# EasyEDA Pro project ProProject_AT32_FOC_2024-04-27.epro, schematic AS5600
Create Date: 2023-11-18; Page Name: AS5600; Project Name: 基于AT32F413 的FOC驱动器; Schematic Name: AS5600; Update Date: 2024-04-27; Company: 嘉立创EDA; Page Size: A3; Version: V1.0
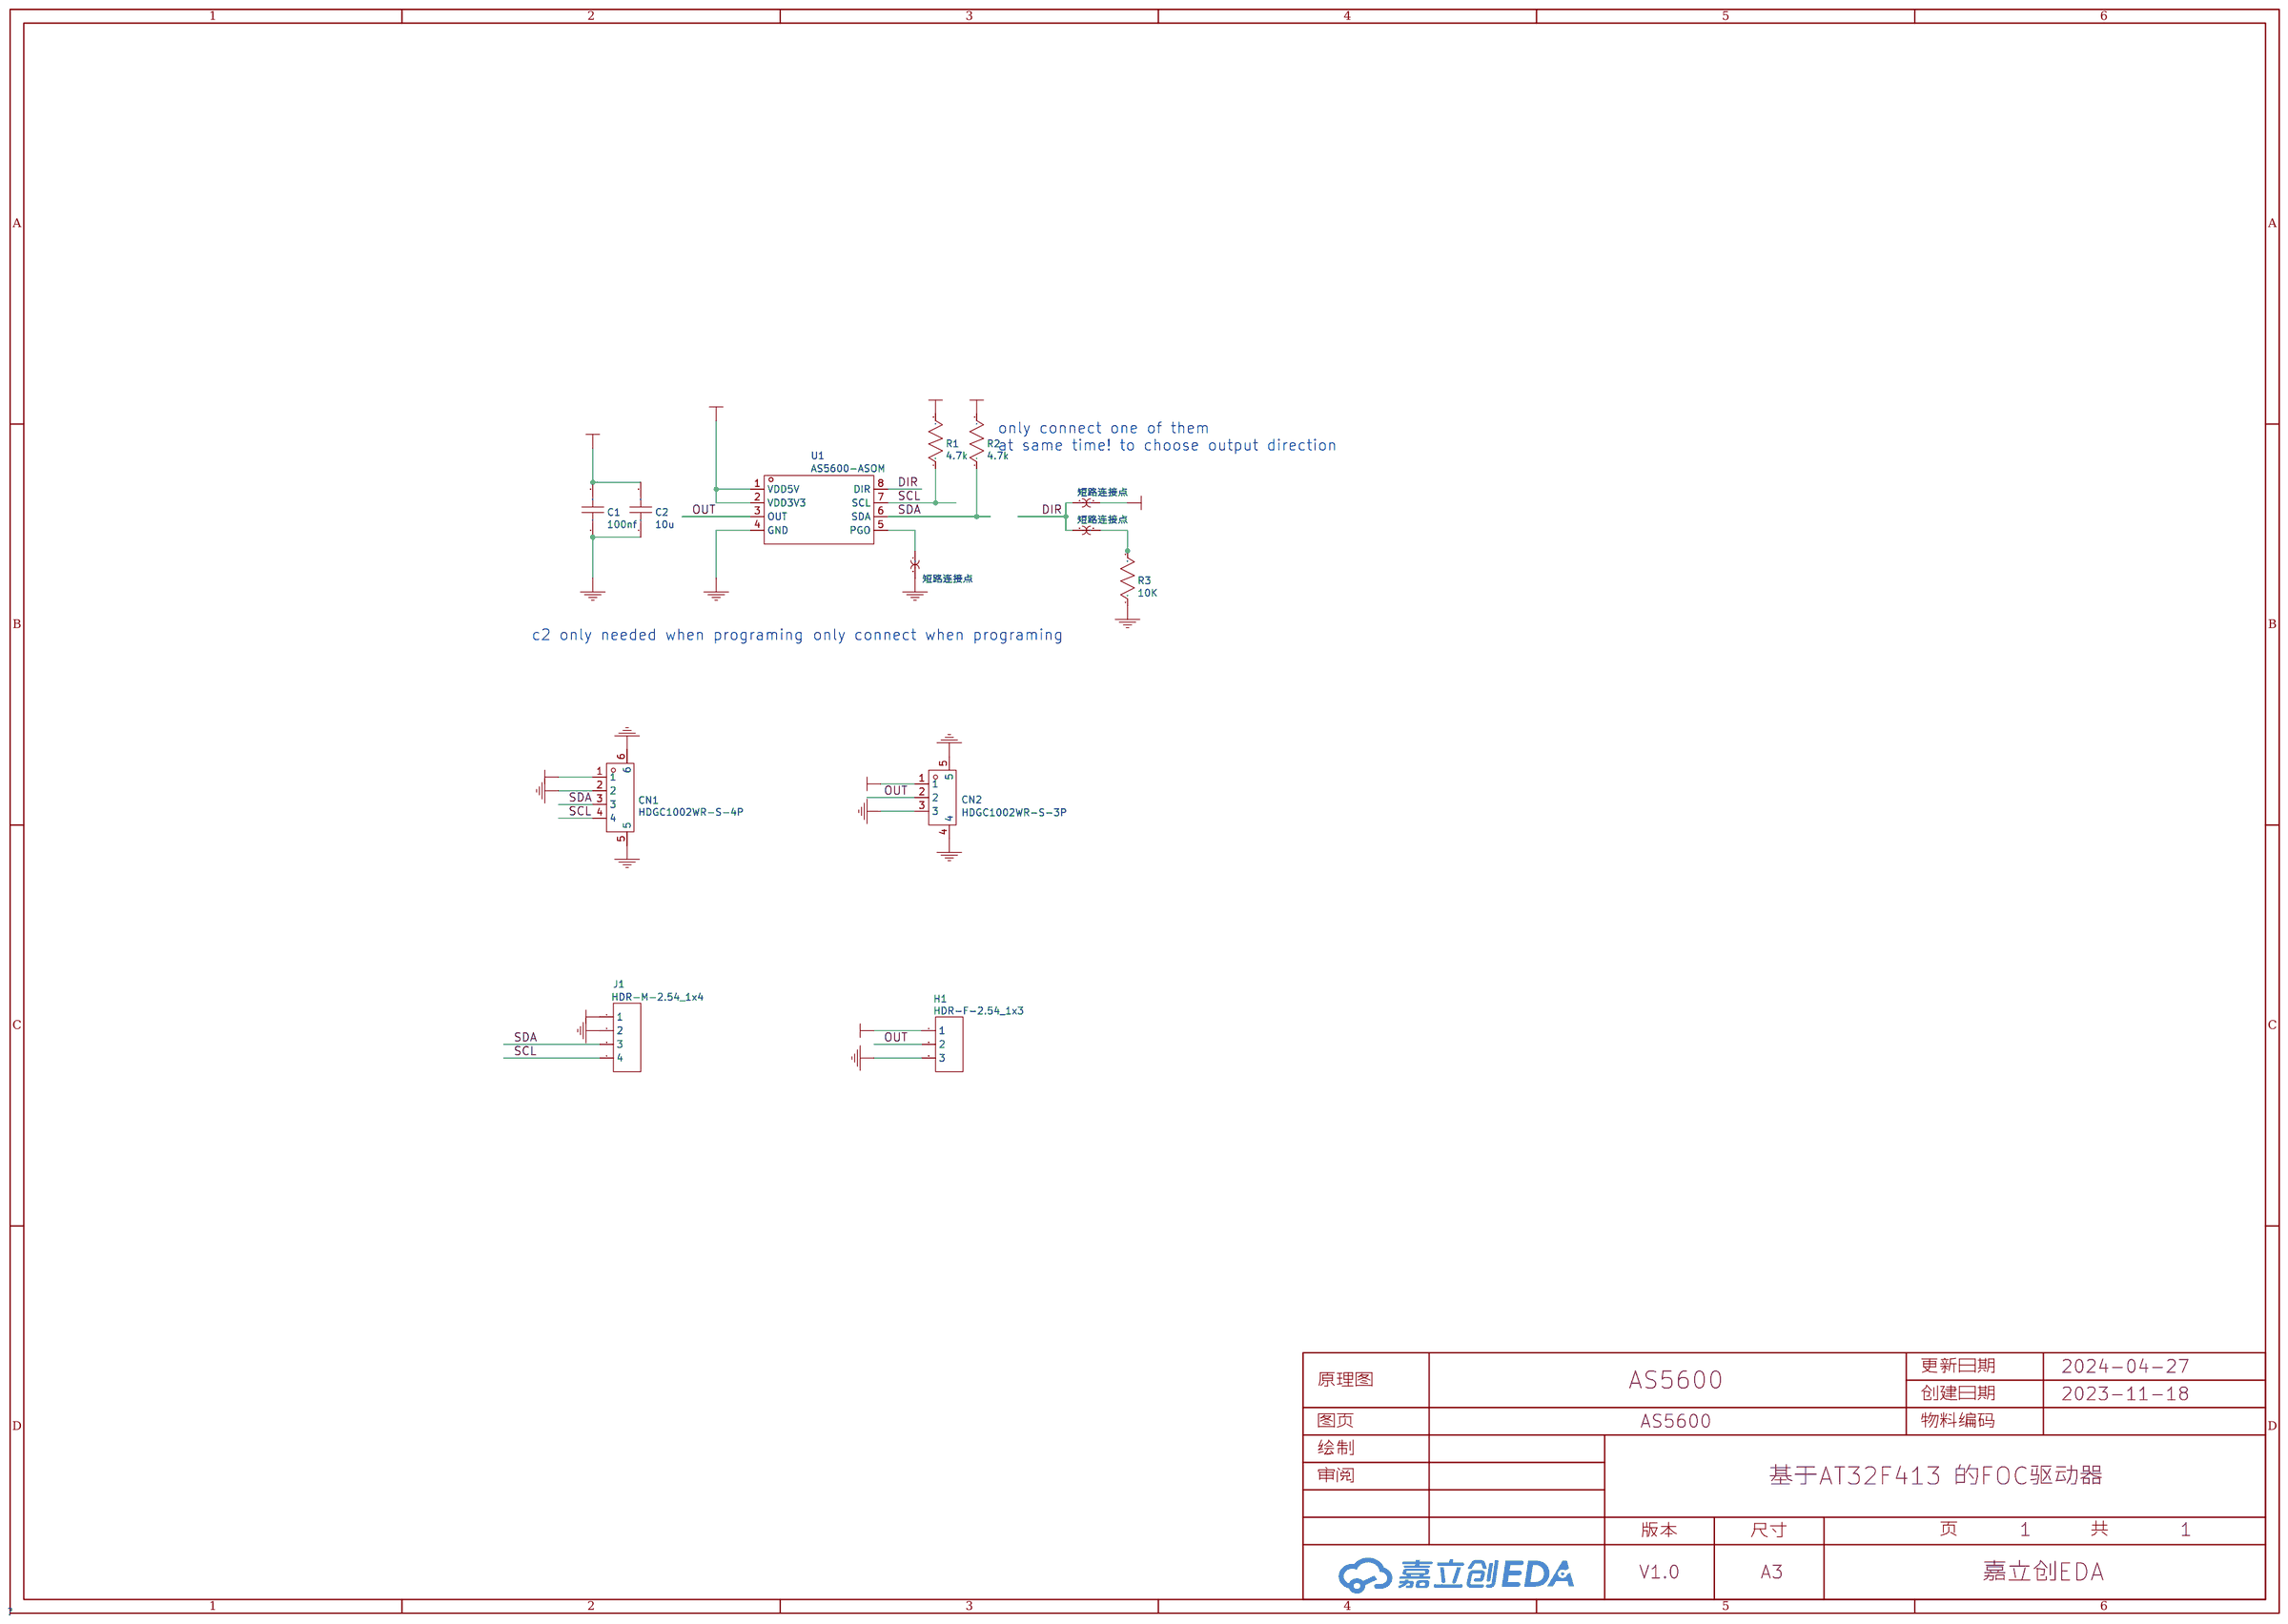
[diagram p1: schematic sheet]

## Parts
C1  100nf  [C0603]
C2  10u  [C0603]
CN1  HDGC1002WR-S-4P  [CONN-SMD_4P-P1.00_HDGC_HDGC1002WR-S-4P]
CN2  HDGC1002WR-S-3P  [CONN-SMD_3P-P1.00_HDGC_HDGC1002WR-S-3P]
H1  HDR-F-2.54_1x3  [HDR-F-2.54_1X3]
J1  HDR-M-2.54_1x4  [HDR-M-2.54_1X4]
NO1  短路连接点  [短路连接点]
NO2  短路连接点  [短路连接点]
NO3  短路连接点  [短路连接点]
R1  4.7k  [R0603]
R2  4.7k  [R0603]
R3  10K  [R0603]
U1  AS5600-ASOM  [SOIC-8_L5.0-W4.0-P1.27-LS6.0-BL]

## Library data of the parts
C1 = 100nf
C2 = 10u
CN1 = HDGC1002WR-S-4P: Supplier: LCSC; Supplier Part: C2936214; Manufacturer: HDGC(华德共创); JLCPCB Part Class: Extended Part
CN2 = HDGC1002WR-S-3P: Supplier: LCSC; Supplier Part: C2936213; Manufacturer: HDGC(华德共创)
H1 = HDR-F-2.54_1x3: Supplier Part: C146690; Supplier: LCSC
J1 = HDR-M-2.54_1x4: Supplier Part: C124378; Supplier: LCSC
NO1-NO3 = 短路连接点: Supplier: MONIK2020
R1 R2 = 4.7k
R3 = 10K
U1 = AS5600-ASOM: Supplier: LCSC; Manufacturer: Ams; Supplier Part: C79815; JLCPCB Part Class: Extended Part

## Nets
+3.3V: C1.2 C2.2 CN1.1 CN2.1 H1.1 J1.1 NO3.1 R1.2 R2.2 U1.1(VDD5V) U1.2(VDD3V3)
GND: C1.1 C2.1 CN1.2 CN1.5 CN1.6 CN2.3 CN2.4 CN2.5 H1.3 J1.2 NO1.2 R3.1 U1.4(GND)
DIR: NO2.2 NO3.2 U1.8(DIR)
OUT: CN2.2 H1.2 U1.3(OUT)
SCL: CN1.4 J1.4 R1.1 U1.7(SCL)
SDA: CN1.3 J1.3 R2.1 U1.6(SDA)
NO2_1: NO2.1 R3.2
U1_5: NO1.1 U1.5(PGO)

## Notes on the sheet
- only connect one of them
  at same time! to choose output direction
- c2 only needed when programing
- only connect when programing
